# Altium schematic sheet 0084_USB3.SchDoc
size 848 x 558 mm
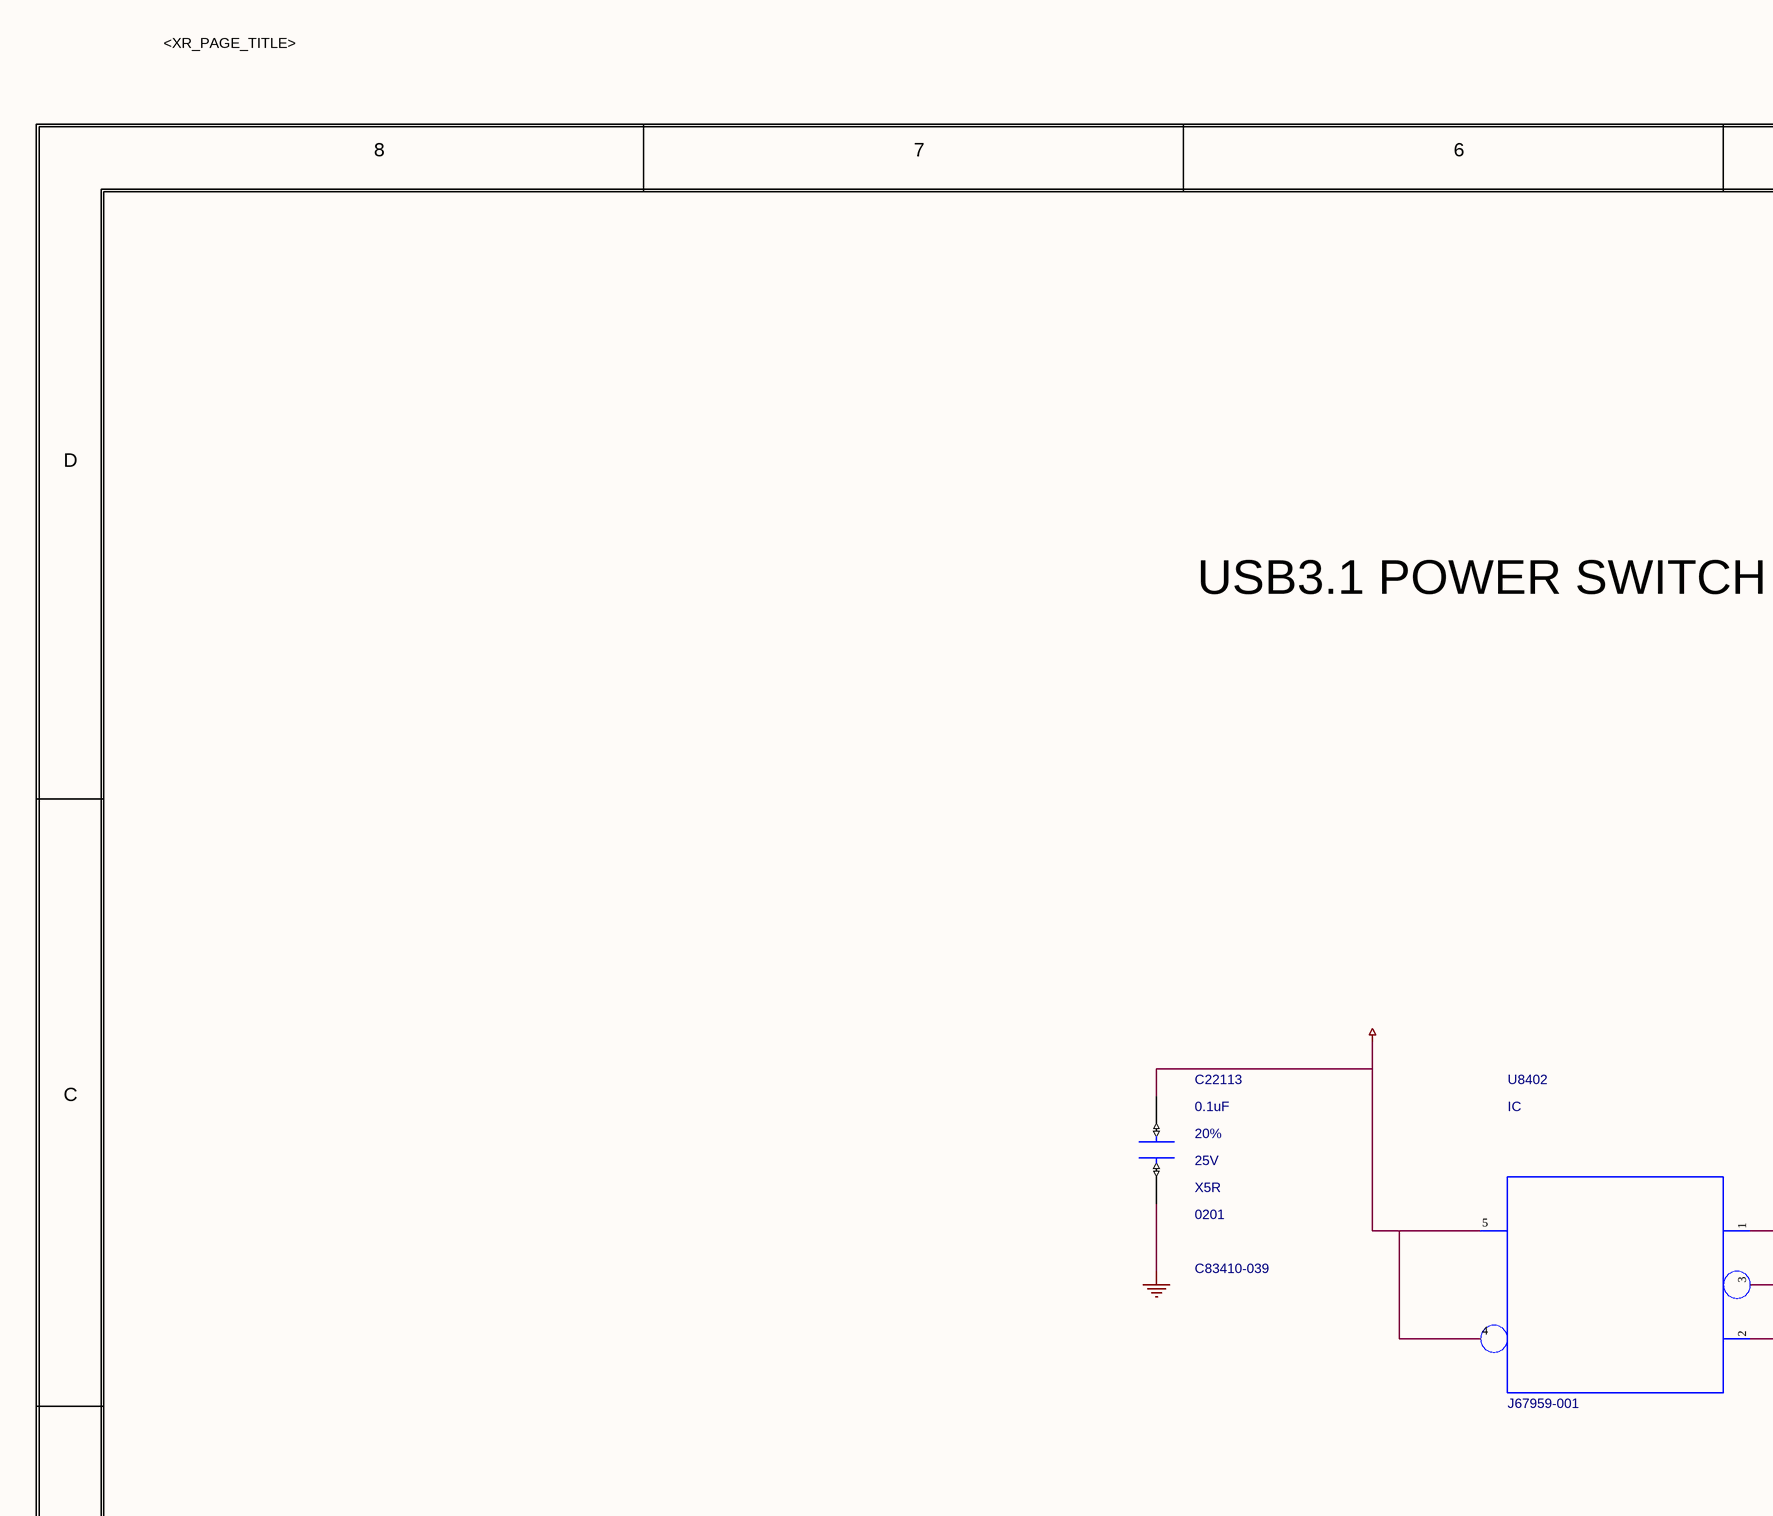
[diagram p0: 0084_USB3.SchDoc, top left]
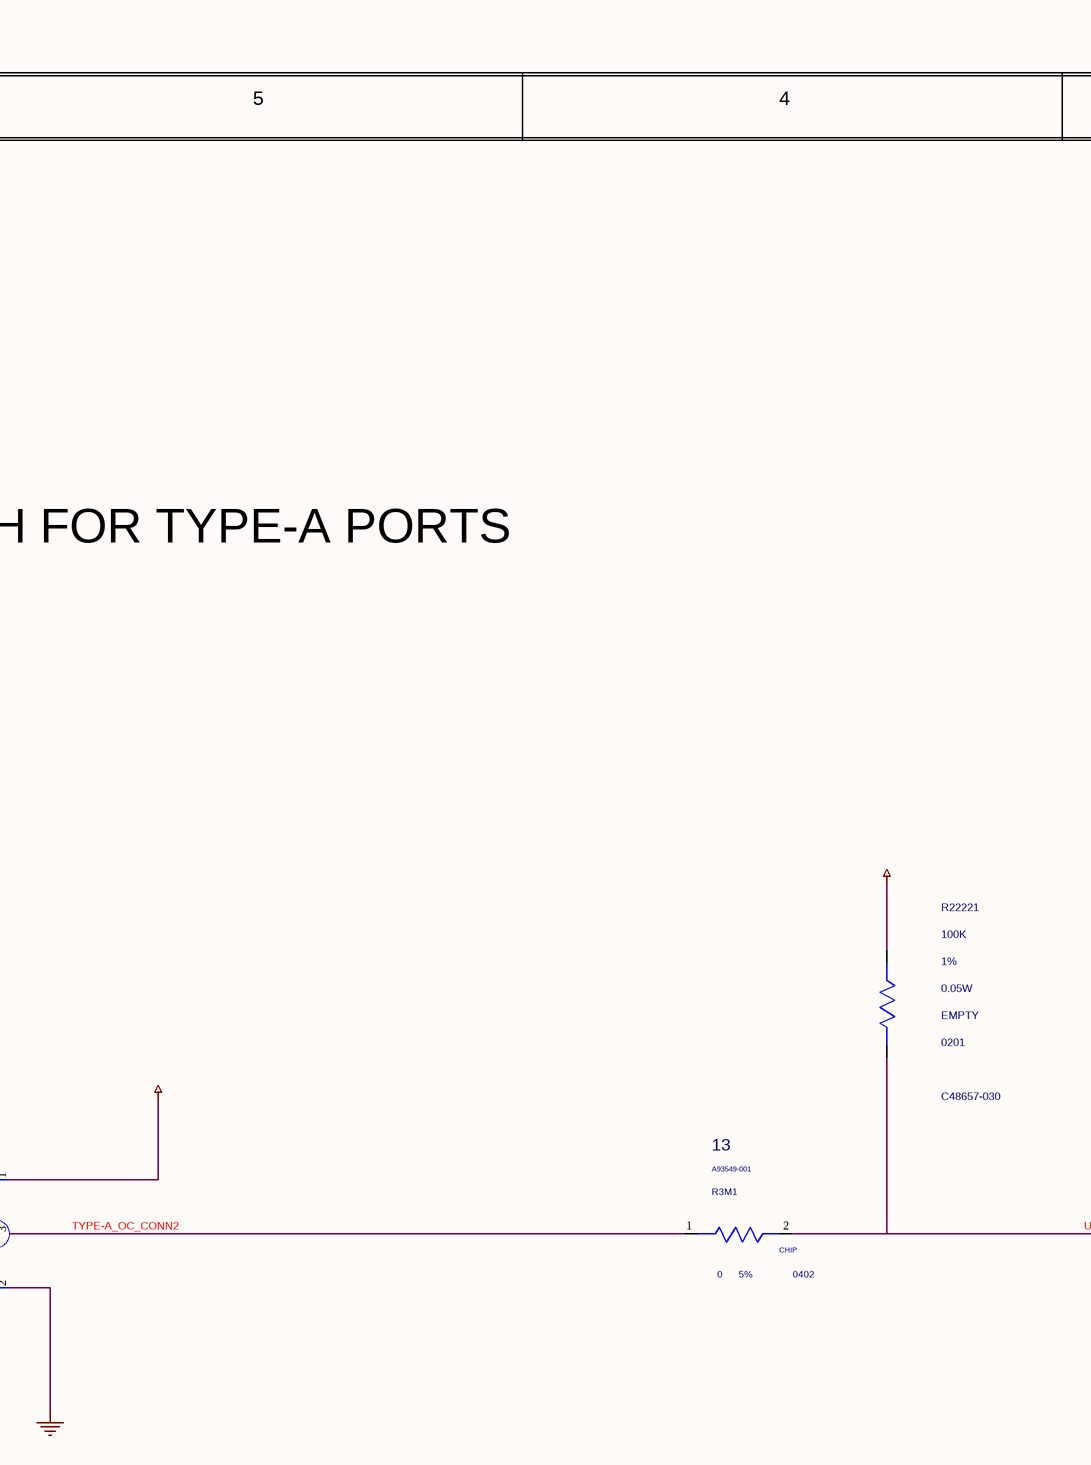
[diagram p1: 0084_USB3.SchDoc, top middle]
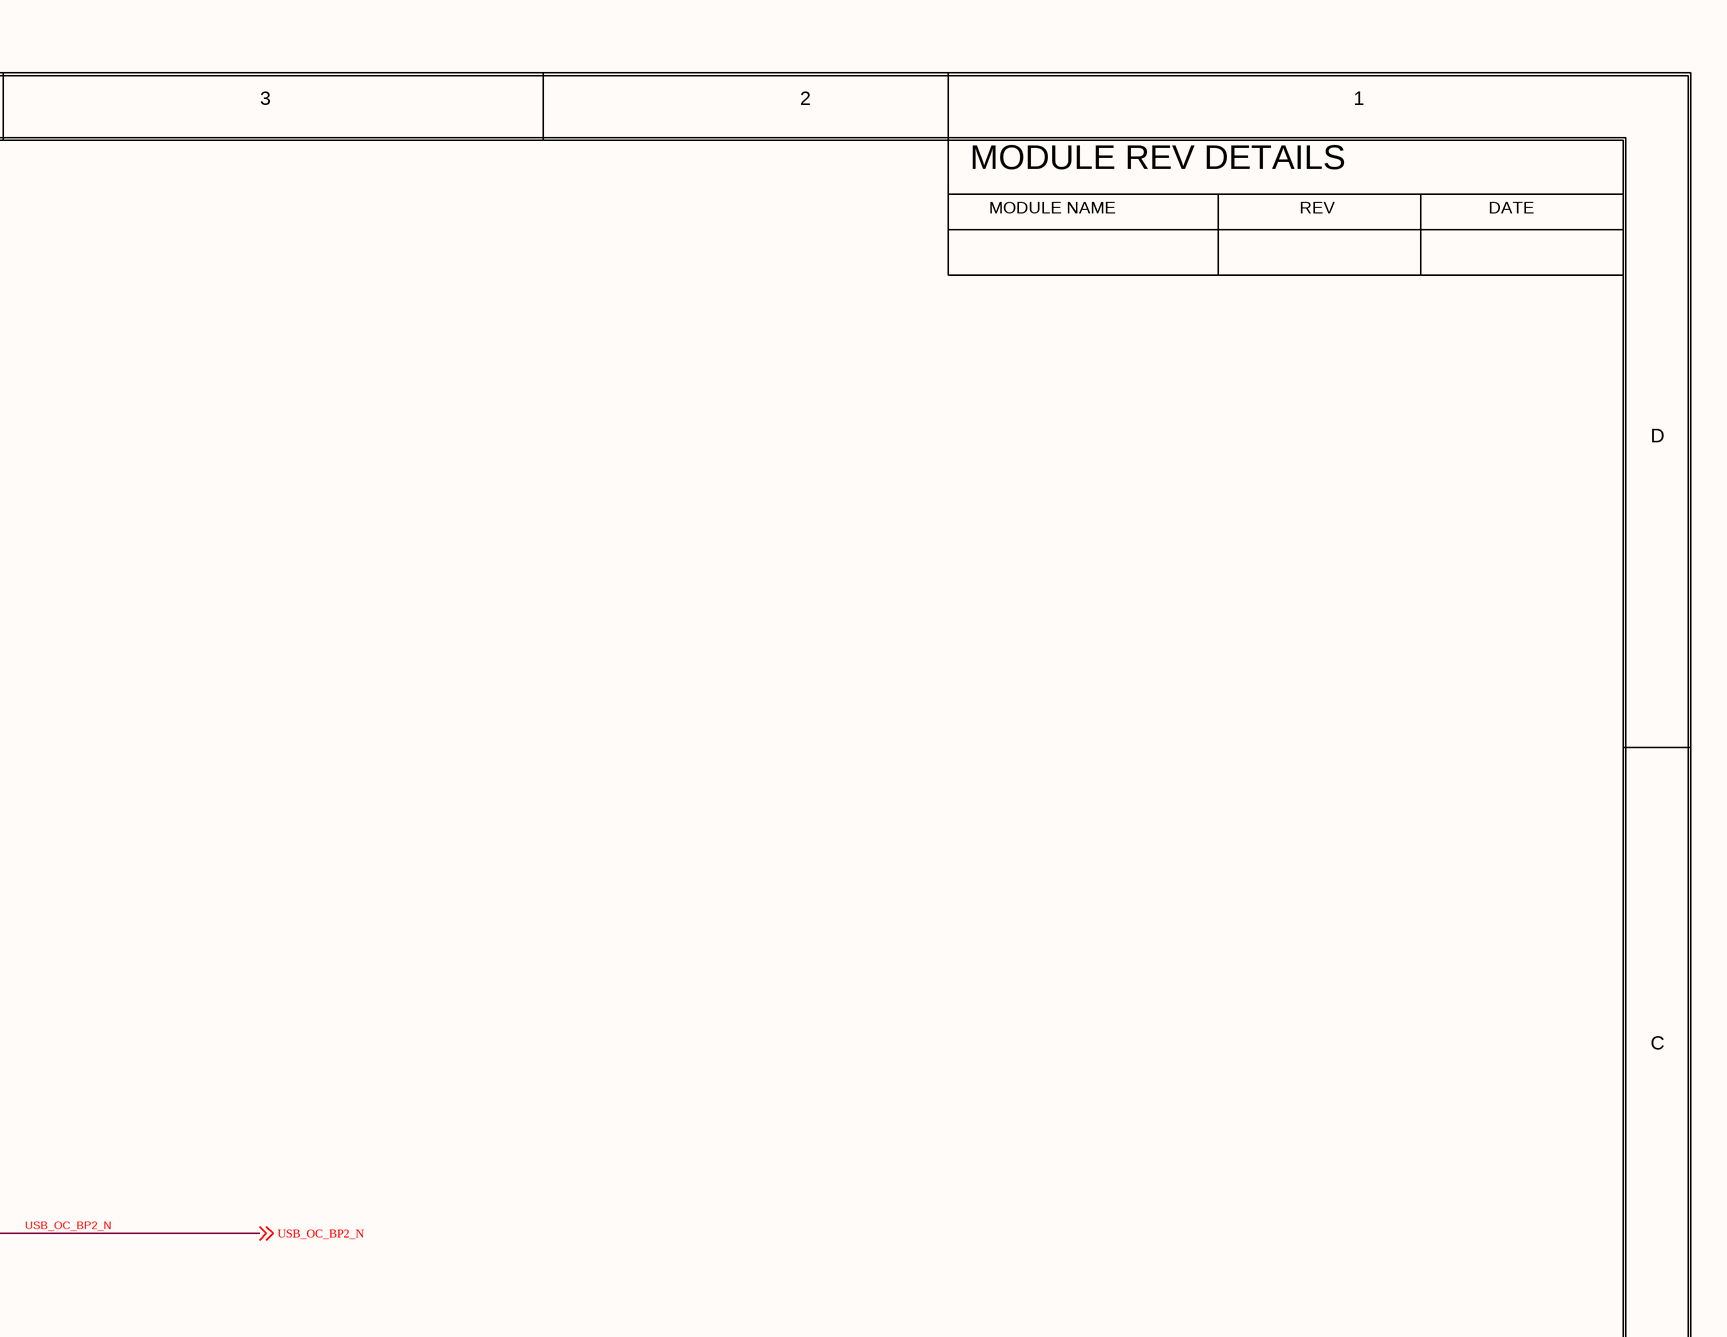
[diagram p2: 0084_USB3.SchDoc, top right]
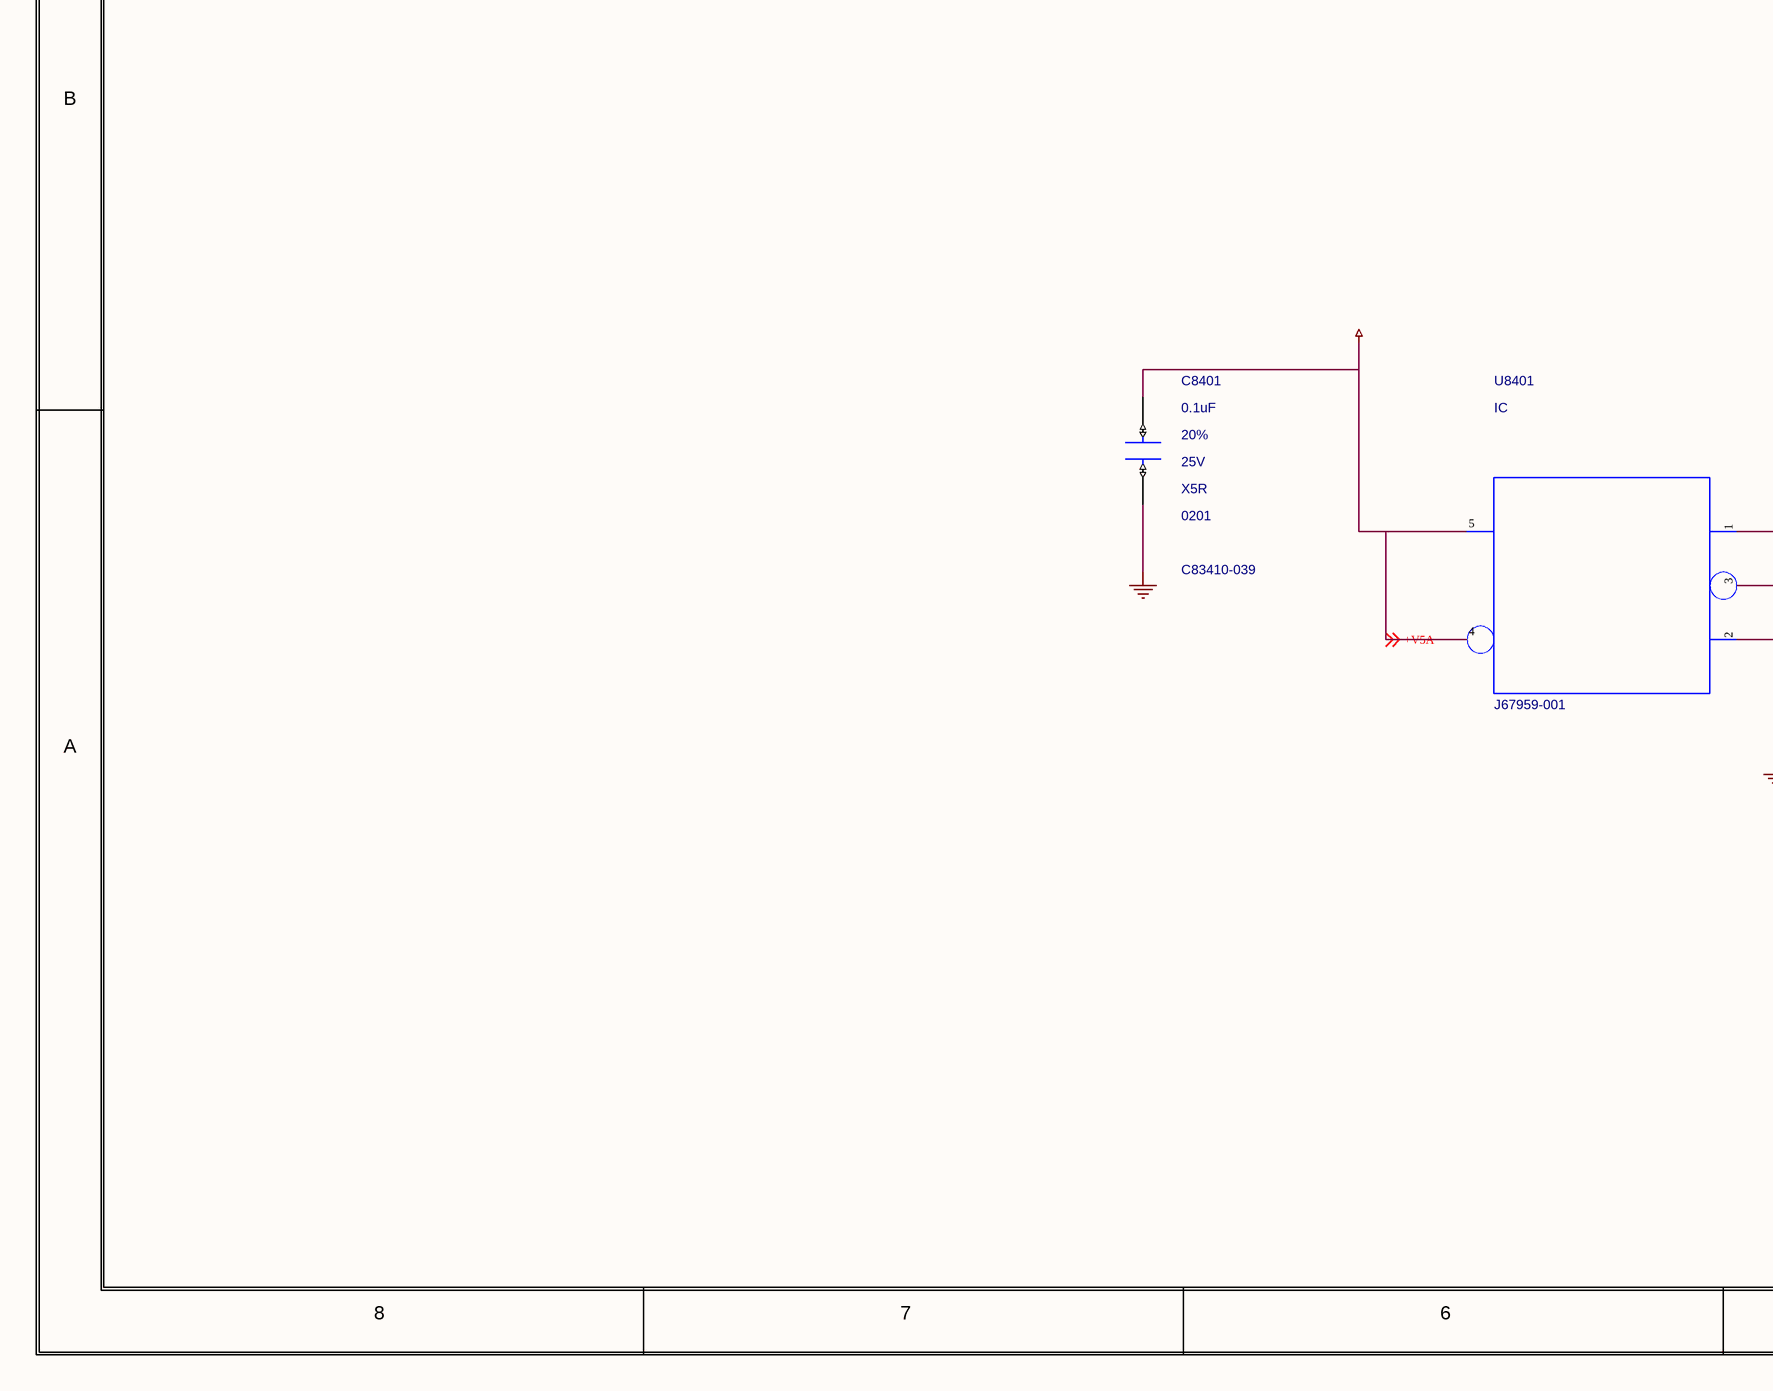
[diagram p3: 0084_USB3.SchDoc, bottom left]
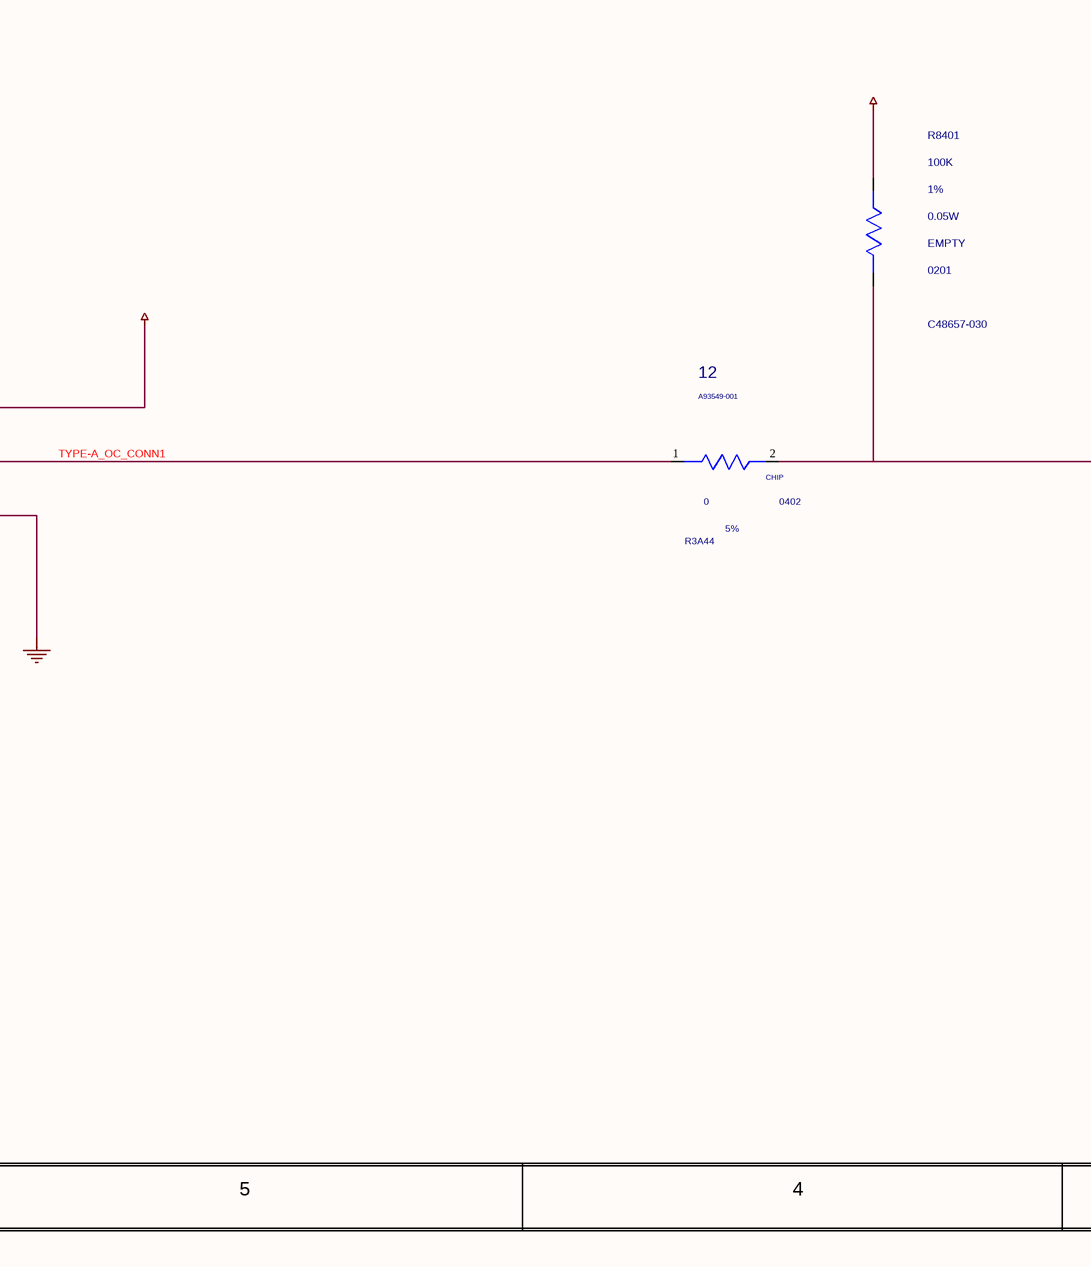
[diagram p4: 0084_USB3.SchDoc, bottom middle]
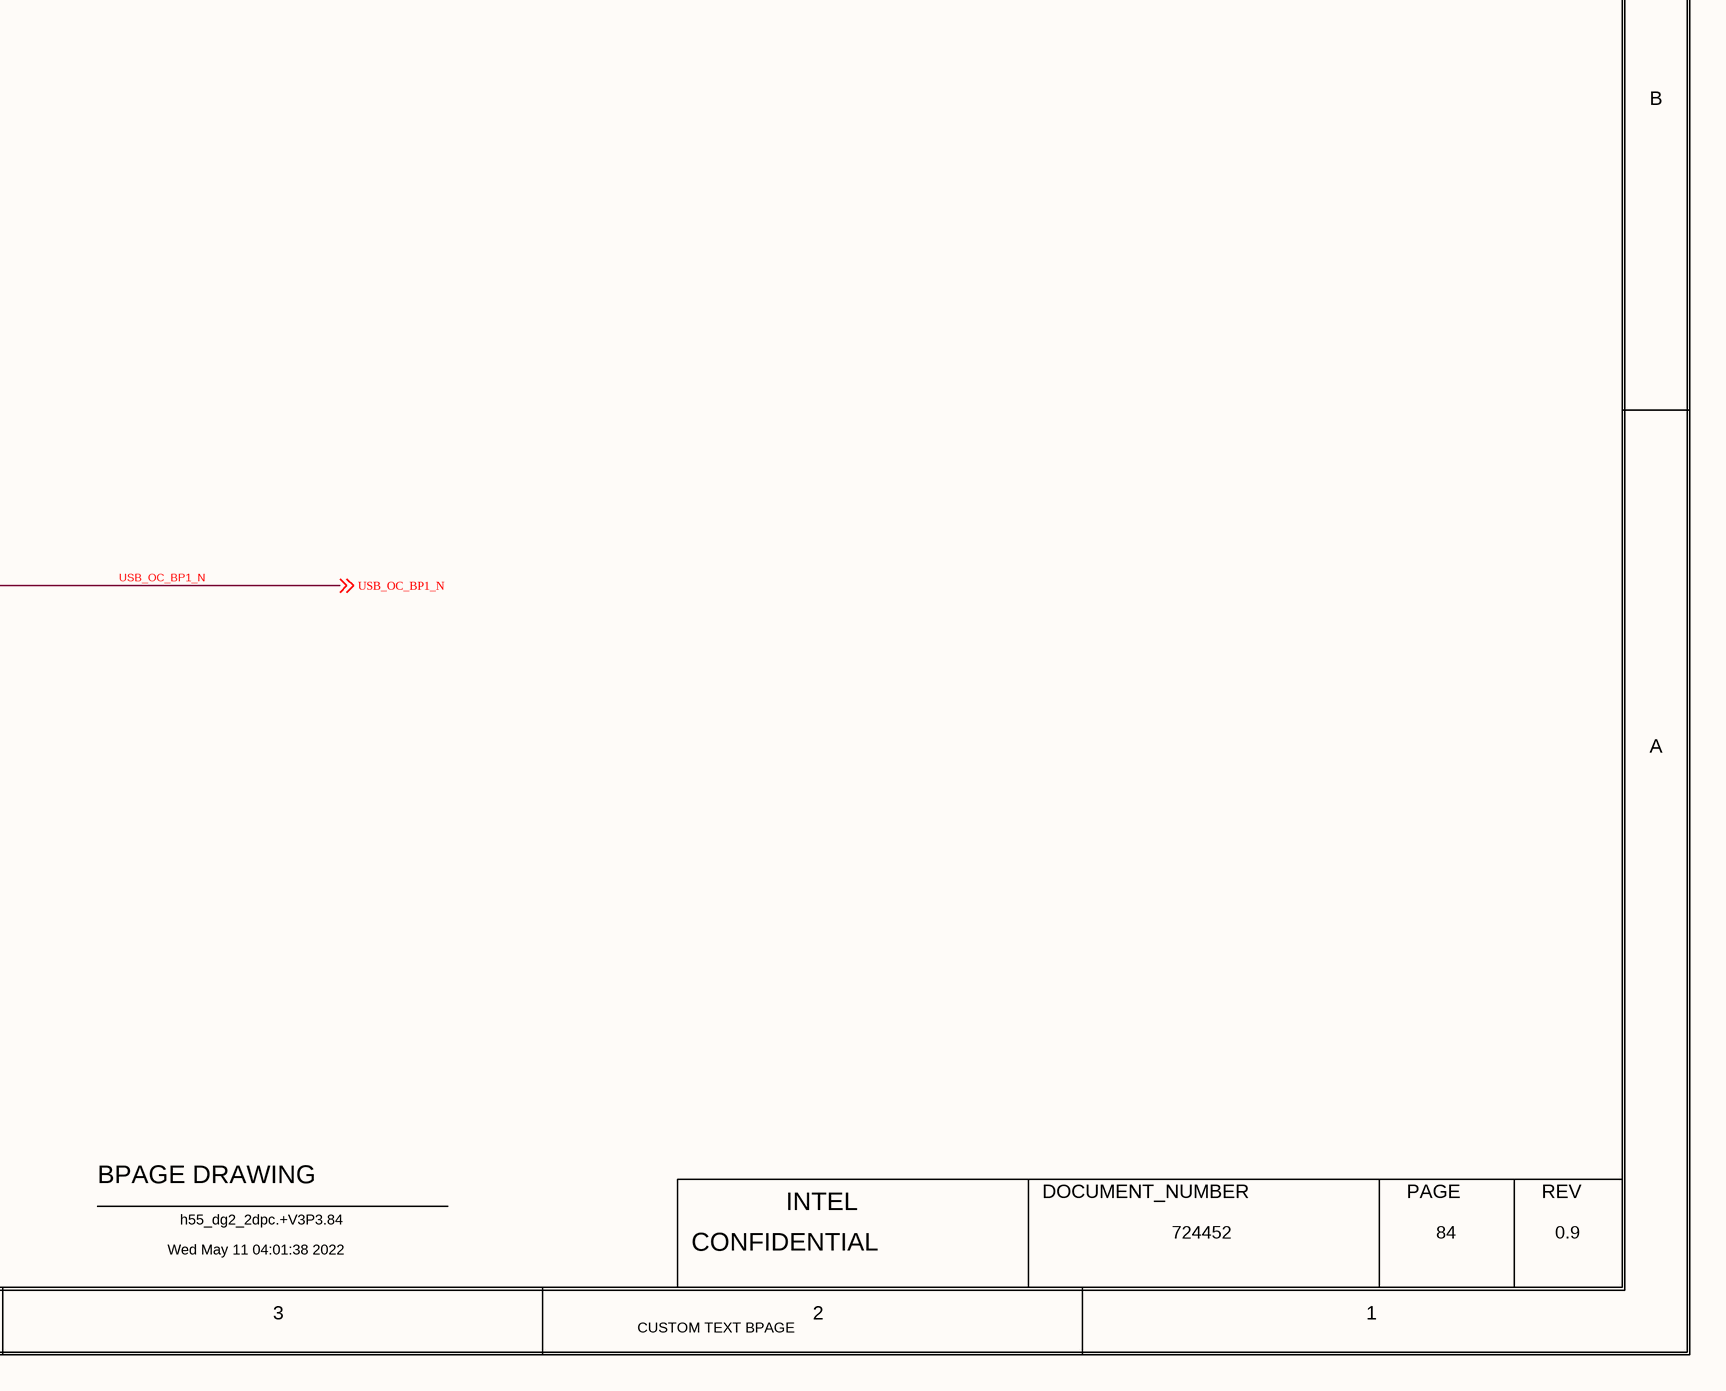
[diagram p5: 0084_USB3.SchDoc, bottom right]

## Parts
C8401  0.1uF  MATERIAL: X5R  PACK_TYPE: 0201  PART_NUMBER: C83410-039  TOLERANCE: 20%  VOLTAGE: 25V  [CTK0_SM0201_630X330_MA]
C22113  0.1uF  MATERIAL: X5R  PACK_TYPE: 0201  PART_NUMBER: C83410-039  TOLERANCE: 20%  VOLTAGE: 25V  [CTK0_SM0201_630X330_MA]
R3A44  0  MATERIAL: CHIP  PACK_TYPE: 0402  PART_NUMBER: A93549-001  TOLERANCE: 5%  REUSE_ID: 12  [SMR0402IA]
R3M1  0  MATERIAL: CHIP  PACK_TYPE: 0402  PART_NUMBER: A93549-001  TOLERANCE: 5%  REUSE_ID: 13  [SMR0402IA]
R8401  100K  MATERIAL: EMPTY  PACK_TYPE: 0201  PART_NUMBER: C48657-030  TOLERANCE: 1%  WATTAGE: 0.05W  [CTK0_SM0201_630X330_MA]
R22221  100K  MATERIAL: EMPTY  PACK_TYPE: 0201  PART_NUMBER: C48657-030  TOLERANCE: 1%  WATTAGE: 0.05W  [CTK0_SM0201_630X330_MA]
U8401  MATERIAL: IC  PART_NUMBER: J67959-001  [CTK2_TSOT23_5_1803X3099_939_MA]  (hidden comment: C_RT9742)
U8402  MATERIAL: IC  PART_NUMBER: J67959-001  [CTK2_TSOT23_5_1803X3099_939_MA]  (hidden comment: C_RT9742)

## Nets
+V3P3A: R8401.1(A) R22221.1(A)
+V5A: C8401.1(A) U8401.4(EN_EN_N) U8401.5(VIN) ; off-sheet +V5A
+V5A_L: C22113.1(A) U8402.4(EN_EN_N) U8402.5(VIN)
+V5A_USB_P1: U8402.1(VOUT)
+V5A_USB_P2: U8401.1(VOUT)
GND: C8401.2(B) C22113.2(B) U8401.2(GND) U8402.2(GND)
TYPE-A_OC_CONN1: R3A44.1(A) U8401.3(FLG_N)
TYPE-A_OC_CONN2: R3M1.1(A) U8402.3(FLG_N)
USB_OC_BP1_N: R3A44.2(B) R8401.2(B) ; off-sheet USB_OC_BP1_N
USB_OC_BP2_N: R3M1.2(B) R22221.2(B) ; off-sheet USB_OC_BP2_N

## Notes on the sheet
- <XR_PAGE_TITLE>
- 8
- 7
- 6
- 5
- 4
- 3
- 2
- 1
- MODULE REV DETAILS
- MODULE NAME
- REV
- DATE
- D
- USB3.1 POWER SWITCH FOR TYPE-A PORTS
- C
- B
- A
- BPAGE DRAWING
- INTEL
- DOCUMENT_NUMBER
- PAGE
- Wed May 11 04:01:38 2022
- h55_dg2_2dpc.+V3P3.84
- CONFIDENTIAL
- 724452
- 84
- 0.9
- CUSTOM TEXT BPAGE

## Library data of the parts
C8401 = C_CAP: CDS_PHYS_PART_NAME: C_CAP_0201-C83410-039,X5R,0.1UF,25V,20%,TK0,GENERIC; CDS_LMAN_SYM_OUTLINE: -50,50,50,-50; FP_TECH: TK0; IP: GENERIC; ROOM: NONE; OriginalSymbolOrigin: (-50,25); XY: (-6075,1550); VER: 1; ROT: 0; PHYS_PAGE: 84; LOCATION: C8401; FIN: EDP; DRAWING: @RVP1_ADL_SB_ADP_S_DDR5_SODIMM_2DPC_LIB.H55_DG2_2DPC(SCH_1):PAGE450; CDS_LIB: c_discrete; BOM: HDMI; VARIANT: ?; PCB Footprint: CTK0_SM0201_630X330_MA; CHIPS_PART_NAME: C_CAP; CDS_PART_NAME: C_CAP_0201-C83410-039,X5R,0.1UF,25V,20%,TK0,GENERIC; CDS_LOCATION: C8401; ASI_MODEL: C83410-039
C22113 = C_CAP: CDS_PHYS_PART_NAME: C_CAP_0201-C83410-039,X5R,0.1UF,25V,20%,TK0,GENERIC; CDS_LMAN_SYM_OUTLINE: -50,50,50,-50; FP_TECH: TK0; IP: GENERIC; ROOM: NONE; OriginalSymbolOrigin: (-50,25); XY: (-6050,3225); VER: 1; ROT: 0; PHYS_PAGE: 84; LOCATION: C22113; FIN: EDP; DRAWING: @RVP1_ADL_SB_ADP_S_DDR5_SODIMM_2DPC_LIB.H55_DG2_2DPC(SCH_1):PAGE450; CDS_LIB: c_discrete; BOM: HDMI; VARIANT: ?; PCB Footprint: CTK0_SM0201_630X330_MA; CHIPS_PART_NAME: C_CAP; CDS_PART_NAME: C_CAP_0201-C83410-039,X5R,0.1UF,25V,20%,TK0,GENERIC; CDS_LOCATION: C22113; ASI_MODEL: C83410-039
R3A44 = RES#1: CHIPS_PART_NAME: RES; CDS_PHYS_PART_NAME: RES_0402-A93549-001,CHIP,0,5%,1/16W,LPDB,GENERIC; WATTAGE: 1/16W; OriginalSymbolOrigin: (-75,25); XY: (-3625,1300); VER: 1; ROOM: ROOM_PROP_TEST_106; PHYS_PAGE: 84; LOCATION: R3A44; DRAWING: @RVP1_ADL_SB_ADP_S_DDR5_SODIMM_2DPC_LIB.H55_DG2_2DPC(SCH_1):PAGE450; CDS_LIB: discrete; PCB Footprint: SMR0402IA; ROT: 0; CDS_PART_NAME: RES_0402-A93549-001,CHIP,0,5%,1/16W,LPDB,GENERIC; CDS_LOCATION: R3A44
R3M1 = RES#1: CHIPS_PART_NAME: RES; CDS_PHYS_PART_NAME: RES_0402-A93549-001,CHIP,0,5%,1/16W,LPDB,GENERIC; WATTAGE: 1/16W; OriginalSymbolOrigin: (-75,25); XY: (-3600,2975); VER: 1; ROOM: ROOM_PROP_TEST_106; PHYS_PAGE: 84; LOCATION: R3M1; DRAWING: @RVP1_ADL_SB_ADP_S_DDR5_SODIMM_2DPC_LIB.H55_DG2_2DPC(SCH_1):PAGE450; CDS_LIB: discrete; PCB Footprint: SMR0402IA; ROT: 0; CDS_PART_NAME: RES_0402-A93549-001,CHIP,0,5%,1/16W,LPDB,GENERIC; CDS_LOCATION: R3M1
R8401 = C_RES: CDS_PHYS_PART_NAME: C_RES_0201-C48657-030,EMPTY,100K,1%,0.05W,TK0,GENERIC; CDS_LMAN_SYM_OUTLINE: -50,50,50,-50; FP_TECH: TK0; IP: GENERIC; ROOM: NONE; OriginalSymbolOrigin: (-25,75); XY: (-3350,1725); VER: 2; ROT: 0; PHYS_PAGE: 84; LOCATION: R8401; DRAWING: @RVP1_ADL_SB_ADP_S_DDR5_SODIMM_2DPC_LIB.H55_DG2_2DPC(SCH_1):PAGE450; CDS_LIB: c_discrete; VARIANT: ?; PCB Footprint: CTK0_SM0201_630X330_MA; SEC_TYPE: 0201; CHIPS_PART_NAME: C_RES; CDS_PART_NAME: C_RES_0201-C48657-030,EMPTY,100K,1%,0.05W,TK0,GENERIC; CDS_LOCATION: R8401
R22221 = C_RES: CDS_PHYS_PART_NAME: C_RES_0201-C48657-030,EMPTY,100K,1%,0.05W,TK0,GENERIC; CDS_LMAN_SYM_OUTLINE: -50,50,50,-50; FP_TECH: TK0; IP: GENERIC; ROOM: NONE; OriginalSymbolOrigin: (-25,75); XY: (-3325,3400); VER: 2; ROT: 0; PHYS_PAGE: 84; LOCATION: R22221; DRAWING: @RVP1_ADL_SB_ADP_S_DDR5_SODIMM_2DPC_LIB.H55_DG2_2DPC(SCH_1):PAGE450; CDS_LIB: c_discrete; VARIANT: ?; PCB Footprint: CTK0_SM0201_630X330_MA; SEC_TYPE: 0201; CHIPS_PART_NAME: C_RES; CDS_PART_NAME: C_RES_0201-C48657-030,EMPTY,100K,1%,0.05W,TK0,GENERIC; CDS_LOCATION: R22221
U8401 = C_RT9742: CDS_PHYS_PART_NAME: C_RT9742_SM-J67959-001,IC,RT9742GGJ5,TK2,GENERIC; CDS_LMAN_SYM_OUTLINE: -200,200,200,-200; FP_TECH: TK2; IP: GENERIC; PACK_TYPE: SM; ROOM: NONE; OriginalSymbolOrigin: (-250,200); XY: (-5225,1300); VER: 1; ROT: 0; PHYS_PAGE: 84; LOCATION: U8401; DRAWING: @RVP1_ADL_SB_ADP_S_DDR5_SODIMM_2DPC_LIB.H55_DG2_2DPC(SCH_1):PAGE450; CDS_LIB: local; VARIANT: ?; PCB Footprint: CTK2_TSOT23_5_1803X3099_939_MA; SEC_TYPE: SM; CHIPS_PART_NAME: C_RT9742; CDS_PART_NAME: C_RT9742_SM-J67959-001,IC,RT9742GGJ5,TK2,GENERIC; CDS_LOCATION: U8401
U8402 = C_RT9742: CDS_PHYS_PART_NAME: C_RT9742_SM-J67959-001,IC,RT9742GGJ5,TK2,GENERIC; CDS_LMAN_SYM_OUTLINE: -200,200,200,-200; FP_TECH: TK2; IP: GENERIC; PACK_TYPE: SM; ROOM: NONE; OriginalSymbolOrigin: (-250,200); XY: (-5200,2975); VER: 1; ROT: 0; PHYS_PAGE: 84; LOCATION: U8402; DRAWING: @RVP1_ADL_SB_ADP_S_DDR5_SODIMM_2DPC_LIB.H55_DG2_2DPC(SCH_1):PAGE450; CDS_LIB: local; VARIANT: ?; PCB Footprint: CTK2_TSOT23_5_1803X3099_939_MA; SEC_TYPE: SM; CHIPS_PART_NAME: C_RT9742; CDS_PART_NAME: C_RT9742_SM-J67959-001,IC,RT9742GGJ5,TK2,GENERIC; CDS_LOCATION: U8402